# Altium schematic sheet 0045_PCH STRAPS 1.SchDoc
size A3
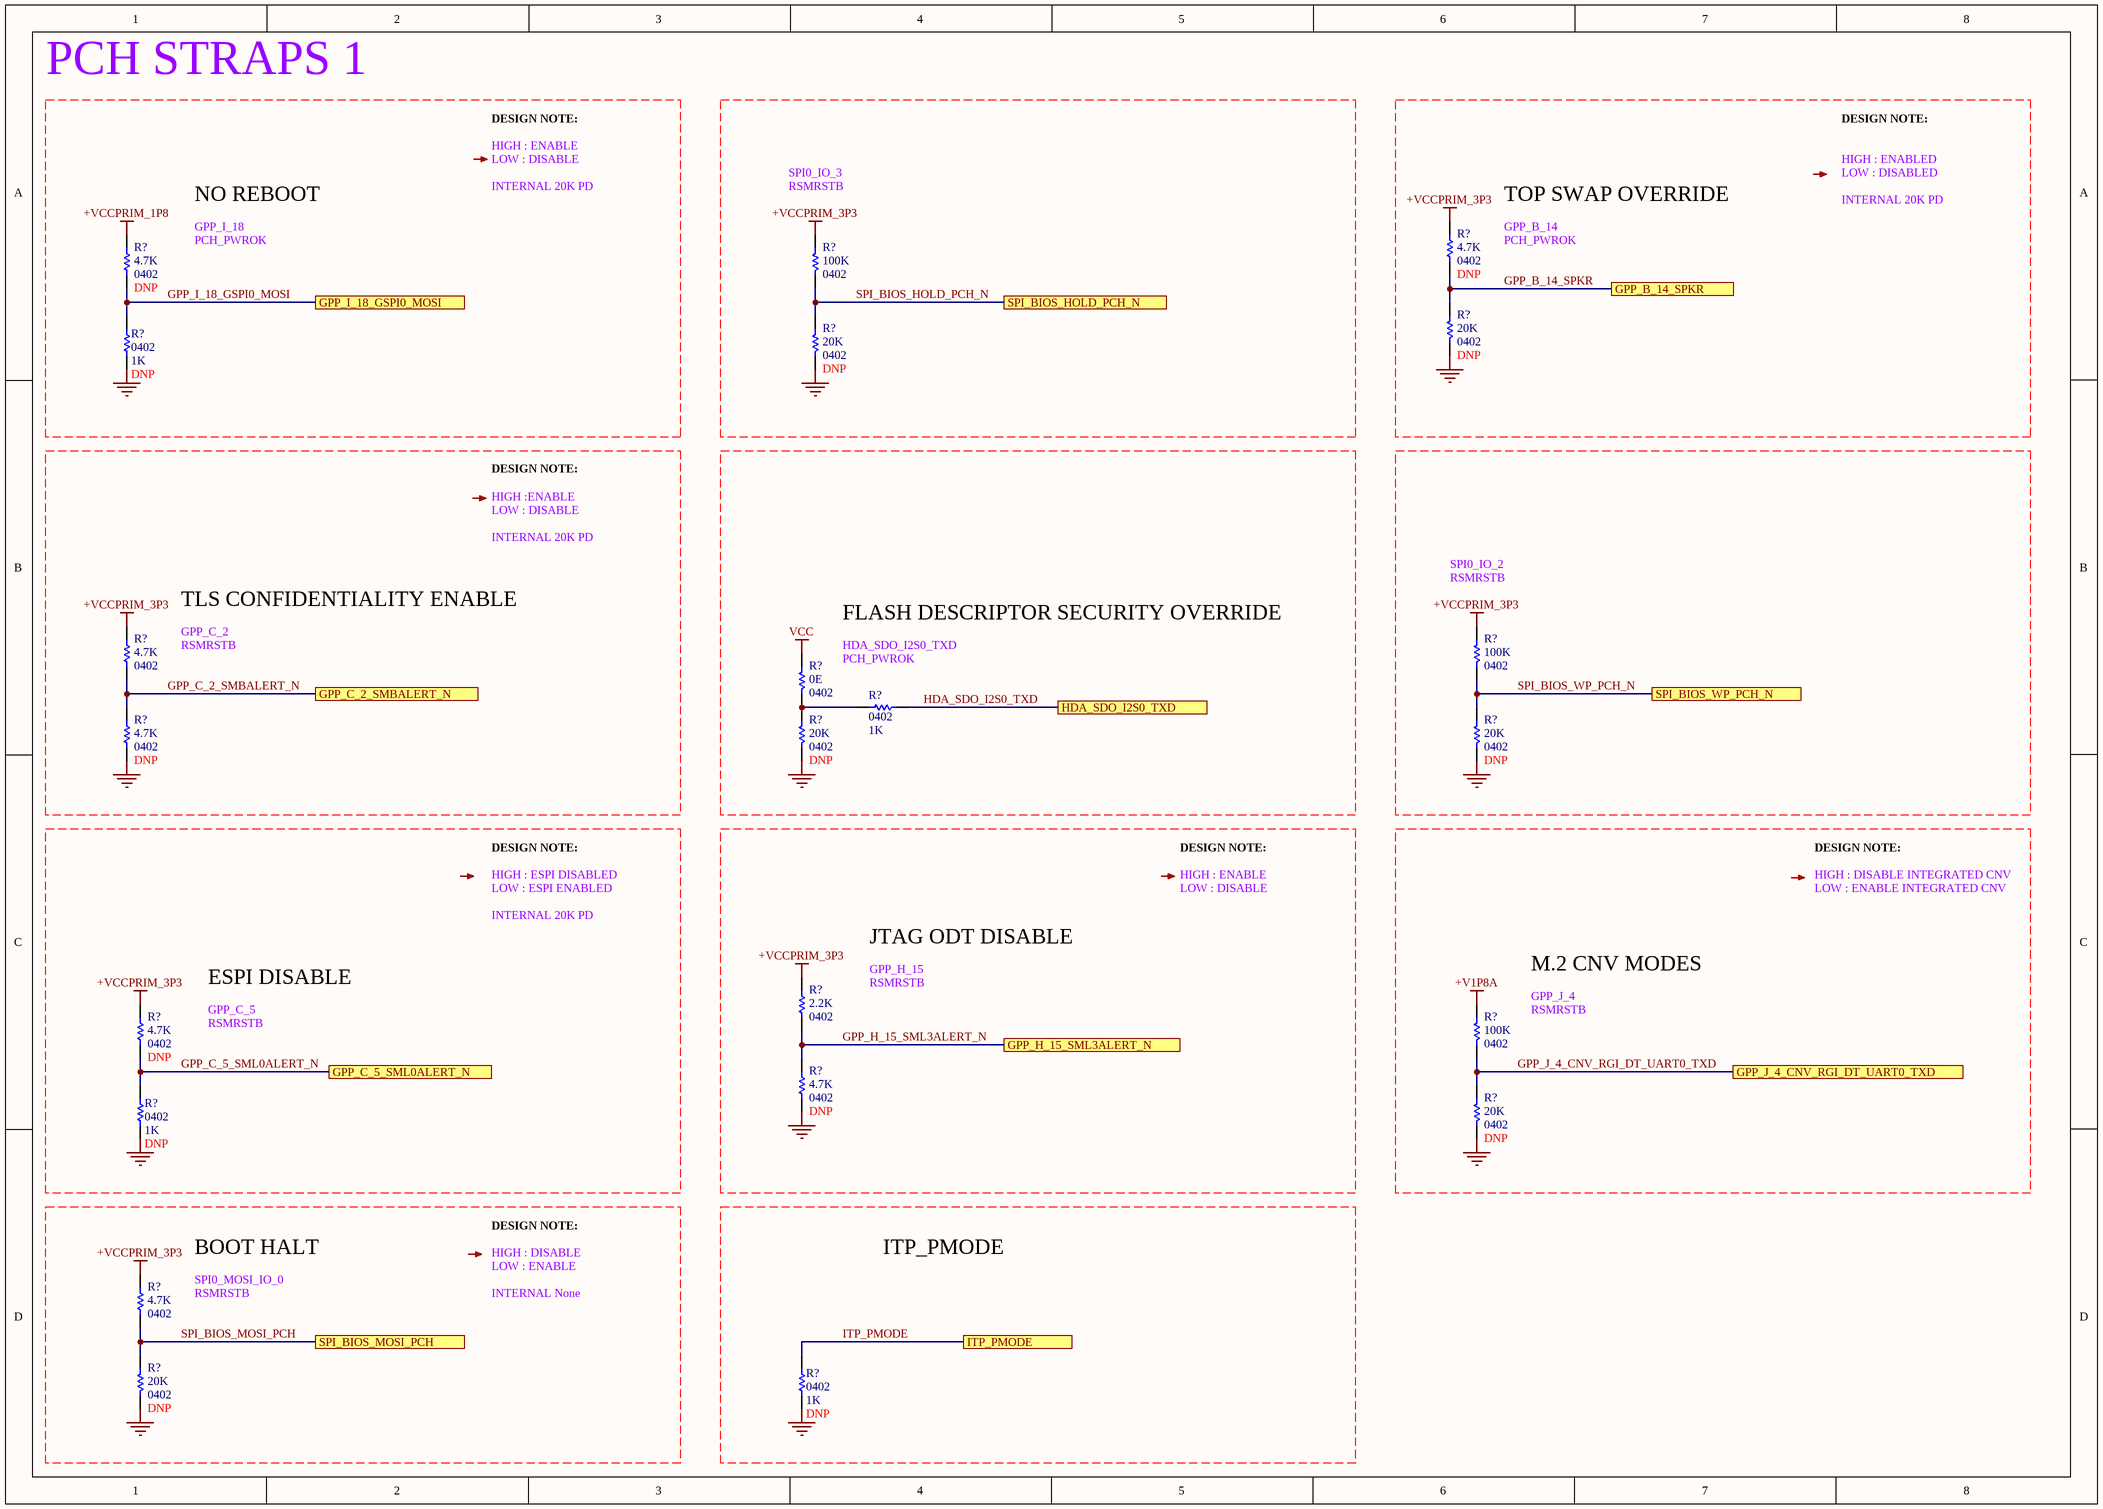
[diagram p0: 0045_PCH STRAPS 1.SchDoc]

## Parts
(Parts that share a designator on the sheet are numbered #1, #2 ... from top to bottom, then left to right.)
R?#1  value 4.7K  Case/Package: 0402  [RESC0402]  (hidden comment: Res)
R?#2  value 4.7K  Case/Package: 0402  [RESC0402]  (hidden comment: Res)
R?#3  value 100K  Case/Package: 0402  [RESC0402]  (hidden comment: Res)
R?#4  value 20K  Case/Package: 0402  [RESC0402]  (hidden comment: Res)
R?#5  value 1K  Case/Package: 0402  [RESC0402]  (hidden comment: Res)
R?#6  value 20K  Case/Package: 0402  [RESC0402]  (hidden comment: Res)
R?#7  value 4.7K  Case/Package: 0402  [RESC0402]  (hidden comment: Res)
R?#8  value 100K  Case/Package: 0402  [RESC0402]  (hidden comment: Res)
R?#9  value 0E  Case/Package: 0402  [RESC0402]  (hidden comment: Res)
R?#10  value 1K  Case/Package: 0402  [RESC0402]  (hidden comment: Res)
R?#11  value 4.7K  Case/Package: 0402  [RESC0402]  (hidden comment: Res)
R?#12  value 20K  Case/Package: 0402  [RESC0402]  (hidden comment: Res)
R?#13  value 20K  Case/Package: 0402  [RESC0402]  (hidden comment: Res)
R?#14  value 2.2K  Case/Package: 0402  [RESC0402]  (hidden comment: Res)
R?#15  value 4.7K  Case/Package: 0402  [RESC0402]  (hidden comment: Res)
R?#16  value 100K  Case/Package: 0402  [RESC0402]  (hidden comment: Res)
R?#17  value 4.7K  Case/Package: 0402  [RESC0402]  (hidden comment: Res)
R?#18  value 1K  Case/Package: 0402  [RESC0402]  (hidden comment: Res)
R?#19  value 20K  Case/Package: 0402  [RESC0402]  (hidden comment: Res)
R?#20  value 4.7K  Case/Package: 0402  [RESC0402]  (hidden comment: Res)
R?#21  value 20K  Case/Package: 0402  [RESC0402]  (hidden comment: Res)
R?#22  value 1K  Case/Package: 0402  [RESC0402]  (hidden comment: Res)

## Ports
GPP_B_14_SPKR, GPP_C_2_SMBALERT_N, GPP_C_5_SML0ALERT_N, GPP_H_15_SML3ALERT_N, GPP_I_18_GSPI0_MOSI, GPP_J_4_CNV_RGI_DT_UART0_TXD, HDA_SDO_I2S0_TXD, ITP_PMODE, SPI_BIOS_HOLD_PCH_N, SPI_BIOS_MOSI_PCH, SPI_BIOS_WP_PCH_N

## Nets
+V1P8A: R?#16.2
+VCCPRIM_1P8: R?#2.2
+VCCPRIM_3P3: R?#1.2 R?#3.2 R?#7.2 R?#8.2 R?#14.2 R?#15.2 R?#20.2
GND: R?#4.1 R?#5.1 R?#6.1 R?#11.1 R?#12.1 R?#13.1 R?#17.1 R?#18.1 R?#19.1 R?#21.1 R?#22.1
VCC: R?#9.2
GPP_B_14_SPKR: R?#1.1 R?#4.2 ; port GPP_B_14_SPKR
GPP_C_2_SMBALERT_N: R?#7.1 R?#11.2 ; port GPP_C_2_SMBALERT_N
GPP_C_5_SML0ALERT_N: R?#15.1 R?#18.2 ; port GPP_C_5_SML0ALERT_N
GPP_H_15_SML3ALERT_N: R?#14.1 R?#17.2 ; port GPP_H_15_SML3ALERT_N
GPP_I_18_GSPI0_MOSI: R?#2.1 R?#5.2 ; port GPP_I_18_GSPI0_MOSI
GPP_J_4_CNV_RGI_DT_UART0_TXD: R?#16.1 R?#19.2 ; port GPP_J_4_CNV_RGI_DT_UART0_TXD
HDA_SDO_I2S0_TXD: R?#10.2 ; port HDA_SDO_I2S0_TXD
ITP_PMODE: R?#22.2 ; port ITP_PMODE
SPI_BIOS_HOLD_PCH_N: R?#3.1 R?#6.2 ; port SPI_BIOS_HOLD_PCH_N
SPI_BIOS_MOSI_PCH: R?#20.1 R?#21.2 ; port SPI_BIOS_MOSI_PCH
SPI_BIOS_WP_PCH_N: R?#8.1 R?#13.2 ; port SPI_BIOS_WP_PCH_N
NetR?#9_1: R?#9.1 R?#10.1 R?#12.2

## Notes on the sheet
- PCH STRAPS 1
- DESIGN NOTE:
- LOW : DISABLE
- HIGH : ENABLE
- SPI0_IO_3
- LOW : DISABLED
- HIGH : ENABLED
- NO REBOOT
- GPP_I_18
- PCH_PWROK
- INTERNAL 20K PD
- RSMRSTB
- GPP_B_14
- TOP SWAP OVERRIDE
- HIGH :ENABLE
- SPI0_IO_2
- TLS CONFIDENTIALITY ENABLE
- GPP_C_2
- FLASH DESCRIPTOR SECURITY OVERRIDE
- (near R?#9) HDA_SDO_I2S0_TXD
- (near R?#10) PCH_PWROK
- HIGH : ESPI DISABLED
- LOW : ESPI ENABLED
- LOW : ENABLE INTEGRATED CNV
- HIGH : DISABLE INTEGRATED CNV
- ESPI DISABLE
- JTAG ODT DISABLE
- GPP_H_15
- M.2 CNV MODES
- GPP_C_5
- GPP_J_4
- BOOT HALT
- HIGH : DISABLE
- ITP_PMODE
- SPI0_MOSI_IO_0
- LOW : ENABLE
- INTERNAL None

## Library data of the parts
R?#1 R?#2 R?#7 R?#11 R?#15 R?#17 R?#20 = Res: Thick Film Resistor -  4.7Kohm, 1%, 0402
  R?#1 R?#2 R?#11 R?#15 R?#17: DNP: DNP
R?#3 R?#8 R?#16 = Res: Thick Film Resistor -  100Kohm, 1%, 0402
R?#4 R?#6 R?#12 R?#13 R?#19 R?#21 = Res: Thick Film Resistor -  20Kohm, 1%, 0402; DNP: DNP
R?#5 R?#10 R?#18 R?#22 = Res: Thick Film Resistor -  1Kohm, 1%, 0402
  R?#5 R?#18 R?#22: DNP: DNP
R?#9 = Res: Thick Film Resistor -  0ohm, 1%, 0402
R?#14 = Res: Thick Film Resistor -  2.2Kohm, 1%, 0402